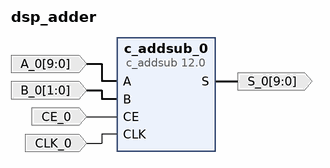
[diagram p0: block diagram of the top level]
# Vivado block design dsp_adder, xc7a35ticpg236-1L, Vivado 2017.4
create_bd_design dsp_adder

create_bd_port -dir I -from 9 -to 0 -type data A_0
create_bd_port -dir I -from 1 -to 0 -type data B_0
create_bd_port -dir I -type ce CE_0
create_bd_port -dir I -type clk CLK_0
create_bd_port -dir O -from 9 -to 0 -type data S_0

create_bd_cell -type ip -vlnv xilinx.com:ip:c_addsub:12.0 c_addsub_0
set_property -dict [list \
  CONFIG.Implementation DSP48 \
  CONFIG.A_Type Unsigned \
  CONFIG.B_Type Unsigned \
  CONFIG.A_Width 10 \
  CONFIG.B_Width 2 \
  CONFIG.Out_Width 10 \
  CONFIG.Latency 2 \
  CONFIG.B_Value 00 \
] [get_bd_cells c_addsub_0]

# ---- connections ----

connect_bd_net -net A_0_1 [get_bd_ports A_0] [get_bd_pins c_addsub_0/A]
connect_bd_net -net B_0_1 [get_bd_ports B_0] [get_bd_pins c_addsub_0/B]
connect_bd_net -net CE_0_1 [get_bd_ports CE_0] [get_bd_pins c_addsub_0/CE]
connect_bd_net -net CLK_0_1 [get_bd_ports CLK_0] [get_bd_pins c_addsub_0/CLK]
connect_bd_net [get_bd_pins c_addsub_0/S] [get_bd_ports S_0]

validate_bd_design
save_bd_design
